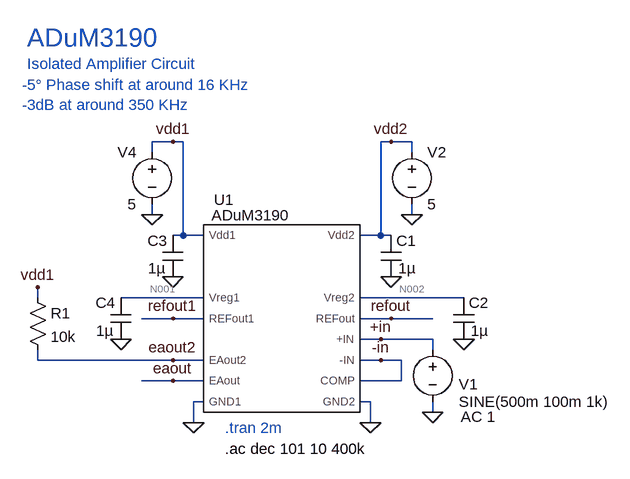
[diagram p0: schematic 05-ADuM3190_ac.asc]
05-ADuM3190_ac.asc, the LTspice schematic file:
Version 4
SHEET 1 880 680
WIRE 64 -96 32 -96
WIRE 80 -96 64 -96
WIRE 400 -96 384 -96
WIRE 432 -96 400 -96
WIRE 32 -80 32 -96
WIRE 432 -80 432 -96
WIRE 32 16 32 0
WIRE 432 16 432 0
WIRE 80 48 80 -96
WIRE 80 48 64 48
WIRE 112 48 80 48
WIRE 384 48 384 -96
WIRE 384 48 352 48
WIRE 400 48 384 48
WIRE -144 144 -144 128
WIRE 112 144 -16 144
WIRE 512 144 352 144
WIRE 64 176 16 176
WIRE 112 176 64 176
WIRE 400 176 352 176
WIRE 464 176 400 176
WIRE 384 208 352 208
WIRE 464 208 384 208
WIRE 464 224 464 208
WIRE -144 240 -144 224
WIRE 64 240 -144 240
WIRE 112 240 64 240
WIRE 384 240 352 240
WIRE 416 240 384 240
WIRE 64 272 16 272
WIRE 112 272 64 272
WIRE 416 272 416 240
WIRE 416 272 352 272
WIRE 112 304 96 304
WIRE 368 304 352 304
WIRE 464 320 464 304
WIRE 96 336 96 304
WIRE 368 336 368 304
FLAG 400 112 0
FLAG 512 208 0
FLAG 400 176 refout
FLAG 384 208 +in
FLAG 384 240 -in
FLAG 368 336 0
FLAG 464 320 0
FLAG 432 16 0
FLAG 400 -96 vdd2
FLAG 64 112 0
FLAG -16 208 0
FLAG 64 176 refout1
FLAG 64 240 eaout2
FLAG 96 336 0
FLAG 32 16 0
FLAG 64 -96 vdd1
FLAG -144 128 vdd1
FLAG 64 272 eaout
SYMBOL ADuM3190 112 320 R0
SYMATTR InstName U1
SYMBOL cap 384 48 R0
WINDOW 3 27 51 Left 2
SYMATTR InstName C1
SYMATTR Value 1µ
SYMATTR SpiceLine V=16 Irms=0 Rser=0 Lser=0 mfg="Murata" pn="GCM188R71C105MA64" type="X7R"
SYMBOL cap 496 144 R0
WINDOW 3 27 51 Left 2
SYMATTR InstName C2
SYMATTR Value 1µ
SYMATTR SpiceLine V=16 Irms=0 Rser=0 Lser=0 mfg="Murata" pn="GCM188R71C105MA64" type="X7R"
SYMBOL voltage 464 208 R0
WINDOW 0 40 69 Left 2
WINDOW 3 40 96 Left 2
WINDOW 123 43 119 Left 2
WINDOW 39 0 0 Left 0
SYMATTR InstName V1
SYMATTR Value SINE(500m 100m 1k)
SYMATTR Value2 AC 1
SYMBOL voltage 432 -96 R0
WINDOW 123 0 0 Left 0
WINDOW 39 0 0 Left 0
SYMATTR InstName V2
SYMATTR Value 5
SYMBOL cap 80 48 M0
WINDOW 3 27 51 Left 2
SYMATTR InstName C3
SYMATTR Value 1µ
SYMATTR SpiceLine V=16 Irms=0 Rser=0 Lser=0 mfg="Murata" pn="GCM188R71C105MA64" type="X7R"
SYMBOL cap 0 144 M0
WINDOW 3 27 51 Left 2
SYMATTR InstName C4
SYMATTR Value 1µ
SYMATTR SpiceLine V=16 Irms=0 Rser=0 Lser=0 mfg="Murata" pn="GCM188R71C105MA64" type="X7R"
SYMBOL voltage 32 -96 M0
WINDOW 123 0 0 Left 0
WINDOW 39 0 0 Left 0
SYMATTR InstName V4
SYMATTR Value 5
SYMBOL res -160 128 R0
SYMATTR InstName R1
SYMATTR Value 10k
TEXT 144 344 Left 2 ;.tran 2m
TEXT 144 376 Left 2 !.ac dec 101 10 400k
TEXT -160 -256 Left 4 ;ADuM3190
TEXT -160 -216 Left 2 ;Isolated Amplifier Circuit
TEXT -168 -184 Left 2 ;-5° Phase shift at around 16 KHz\n-3dB at around 350 KHz

The netlist it stands for:
* 05-ADuM3190_ac.asc
XU1 vdd1 N001 refout1 eaout2 eaout 0 0 -in -in +in refout N002 vdd2 ADuM3190  ; pins Vdd1 Vreg1 REFout1 EAout2 EAout GND1 GND2 COMP -IN +IN REFout Vreg2 Vdd2
C1 vdd2 0 1µ V=16 Irms=0 Rser=0 Lser=0 mfg="Murata" pn="GCM188R71C105MA64" type="X7R"
C2 N002 0 1µ V=16 Irms=0 Rser=0 Lser=0 mfg="Murata" pn="GCM188R71C105MA64" type="X7R"
V1 +in 0 SINE(500m 100m 1k) AC 1
V2 vdd2 0 5
C3 vdd1 0 1µ V=16 Irms=0 Rser=0 Lser=0 mfg="Murata" pn="GCM188R71C105MA64" type="X7R"
C4 N001 0 1µ V=16 Irms=0 Rser=0 Lser=0 mfg="Murata" pn="GCM188R71C105MA64" type="X7R"
V4 vdd1 0 5
R1 vdd1 eaout2 10k
* .tran 2m
.ac dec 101 10 400k
* ADuM3190
* Isolated Amplifier Circuit
* -5° Phase shift at around 16 KHz
* -3dB at around 350 KHz
.lib C:\Users\hop\Documents\GitHub\LTspice\01-lib\ADuM3190B.sub
.backanno
.end

* Results of the author's LTspice run, read from the files saved beside the schematic
* Operating Point, zero values left out:
*   V(-in) = 500 mV
*   V(+in) = 500 mV
*   V(eaout2) = 1.305 V
*   V(refout1) = 1.223 V
*   V(vdd1) = 5 V
*   V(refout) = 1.223 V
*   V(vdd2) = 5 V
*   V(n002) = 3 V
*   V(n001) = 3 V
*   V(eaout) = 500.3 mV
*   I(R1) = 369.5 µA
*   I(V2) = -2 mA
*   I(V4) = -5.37 mA
*   Ix(u1:VDD1) = 5 mA
*   Ix(u1:EAOUT2) = 369.5 µA
*   Ix(u1:GND1) = -5.37 mA
*   Ix(u1:GND2) = -2 mA
*   Ix(u1:VDD2) = 2 mA
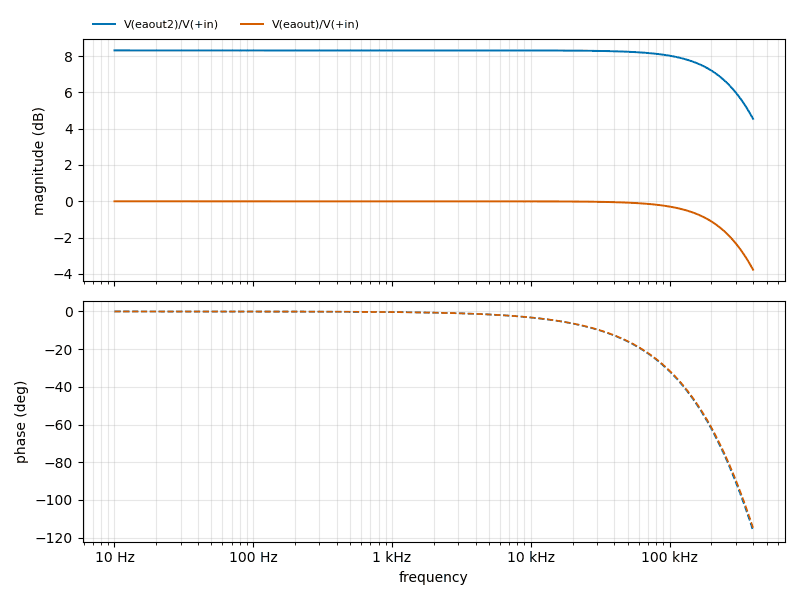
[diagram p1: AC Analysis of 05-ADuM3190_ac.asc, plotted from the saved traces]
* AC Analysis, 1 run:
*   V(eaout2)/V(+in): 8.32 dB at 10 Hz, 4.54 dB at 400 kHz, peak 8.32 dB at 10 Hz, 3 dB below the peak at 349 kHz
*   V(eaout)/V(+in): -0.00 dB at 10 Hz, -3.77 dB at 400 kHz, peak -0.00 dB at 10 Hz, 3 dB below the peak at 349.1 kHz